# EasyEDA schematic 1-Schematic_Trial Project.json
TITLE: Sheet_1; REV: 1.0; Date: 2025-05-23; Sheet: 1/1; Drawn By: athulkrishnaat7; Company: Your Company
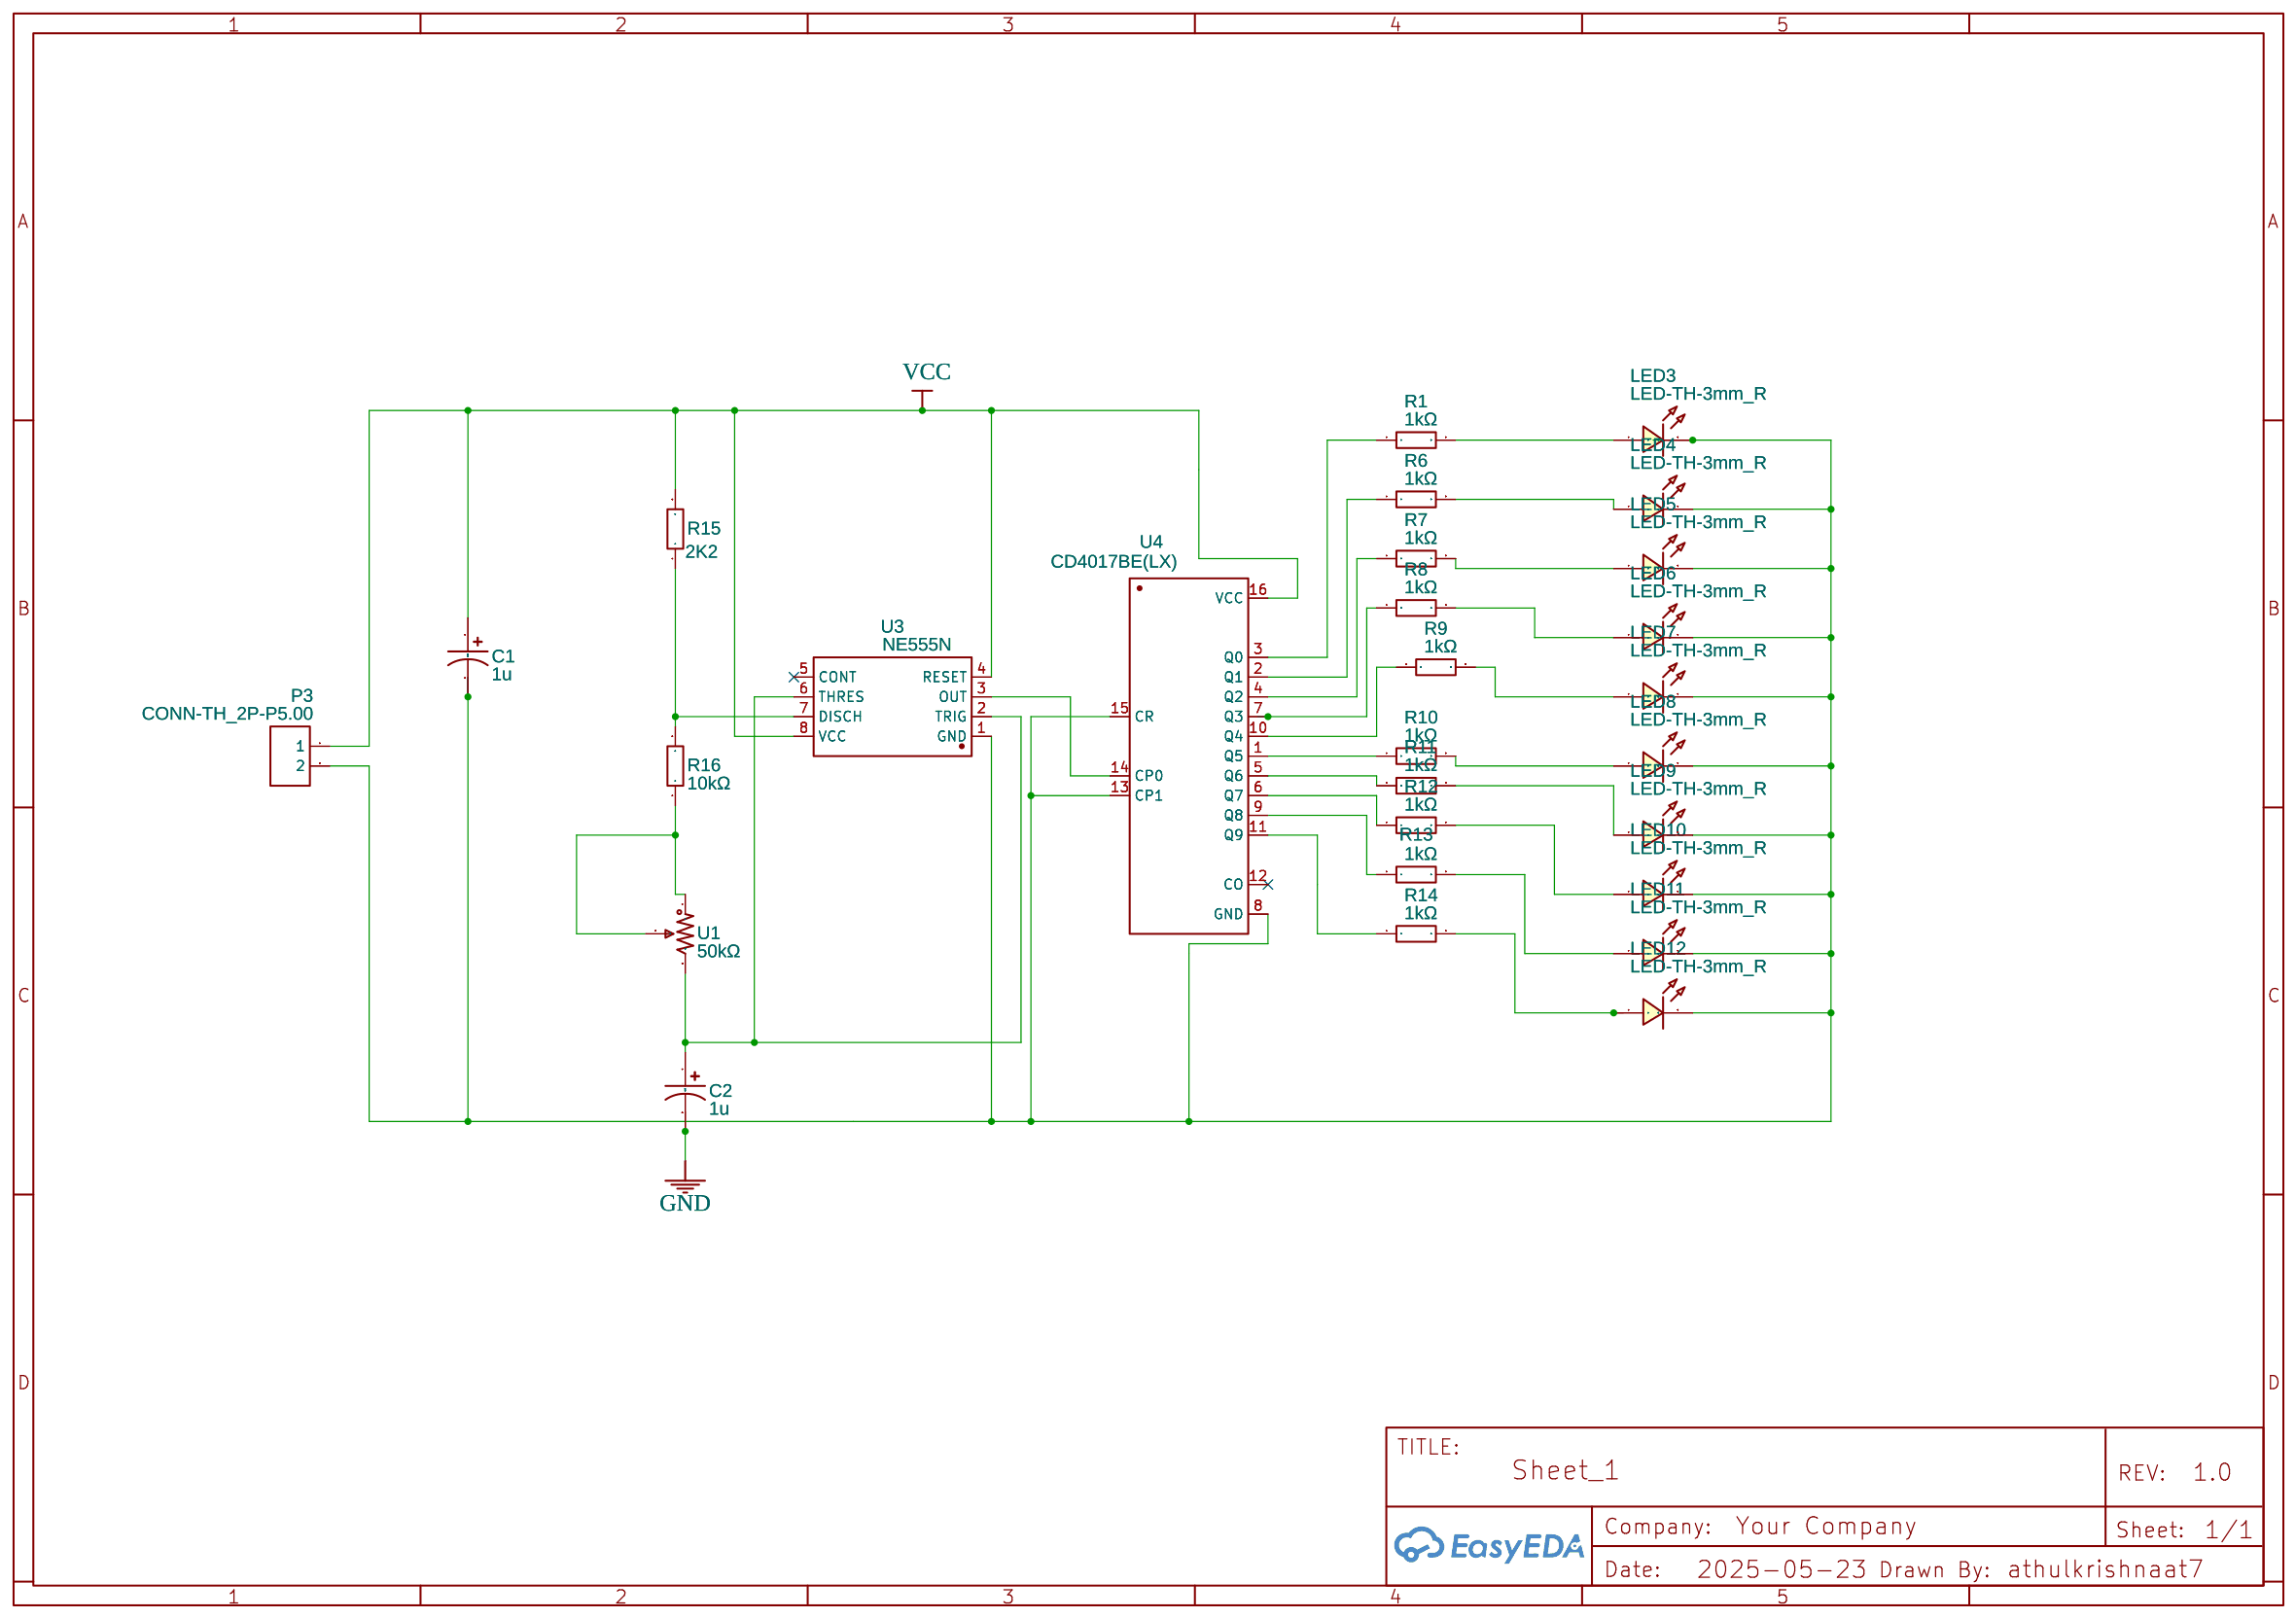
[diagram p0: schematic sheet]

## Parts
C1  1u  [CASE-A_3216]
C2  1u  [CASE-A_3216]
LED3  LED-TH-3mm_R  [LED-TH_BD3.0_RED]
LED4  LED-TH-3mm_R  [LED-TH_BD3.0_RED]
LED5  LED-TH-3mm_R  [LED-TH_BD3.0_RED]
LED6  LED-TH-3mm_R  [LED-TH_BD3.0_RED]
LED7  LED-TH-3mm_R  [LED-TH_BD3.0_RED]
LED8  LED-TH-3mm_R  [LED-TH_BD3.0_RED]
LED9  LED-TH-3mm_R  [LED-TH_BD3.0_RED]
LED10  LED-TH-3mm_R  [LED-TH_BD3.0_RED]
LED11  LED-TH-3mm_R  [LED-TH_BD3.0_RED]
LED12  LED-TH-3mm_R  [LED-TH_BD3.0_RED]
P3  CONN-TH_2P-P5.00  [CONN-TH_2P-P5.00]
R1  1kΩ  [R1210]
R6  1kΩ  [R1210]
R7  1kΩ  [R1210]
R8  1kΩ  [R1210]
R9  1kΩ  [R1210]
R10  1kΩ  [R1210]
R11  1kΩ  [R1210]
R12  1kΩ  [R1210]
R13  1kΩ  [R1210]
R14  1kΩ  [R1210]
R15  2K2  [R1210]
R16  10kΩ  [R1210]
U1  50kΩ  [RES-ADJ-SMD_RM065-V1]
U3  NE555N  [SOIC-8_L4.9-W3.9-P1.27-LS6.2-BL]
U4  CD4017BE(LX)  [SOIC-16_L9.9-W3.9-P1.27-LS6.0-BR]

## Library data of the parts
C1 C2 = C_Tan_SMD_A_US: Contributor: LCEDA_Lib
LED3-LED12 = LED-TH-3mm_R: Manufacturer: EVERLIGHT(台湾亿光); Manufacturer Part: 204-10SDRD/S530-A3-L; Supplier Part: C84774; Supplier: LCSC; Contributor: LCEDA_Lib
P3 = CONN-TH_2P-P5.00: Supplier: LCSC; Contributor: LCEDA_Lib
R1 R6-R16 = CR1210J30102G: Contributor: LCSC; Supplier: LCSC; Supplier Part: C102400; Manufacturer: LIZ(丽智电子); JLCPCB Part Class: Extended Part
U1 = 67WR50KLF: Supplier: LCSC; Supplier Part: C6826043; Manufacturer: TT Electronics; Contributor: lcsc; JLCPCB Part Class: Extended Part
U3 = NE555N: Contributor: LCSC; Supplier: LCSC; Supplier Part: C398063; Manufacturer: HGSEMI(华冠); JLCPCB Part Class: Extended Part
U4 = CD4017BE(LX): Supplier: LCSC; Supplier Part: C32710674; Manufacturer: LX(灵星芯微); Contributor: lcsc; JLCPCB Part Class: Extended Part

## Nets
GND: C1.2 C2.2 LED3.2 LED4.2 LED5.2 LED6.2 LED7.2 LED8.2 LED9.2 LED10.2 LED11.2 LED12.2 P3.2 U3.1(GND) U4.8(GND) U4.13(CP1) U4.15(CR)
VCC: C1.1 P3.1 R15.2 U3.4(RESET) U3.8(VCC) U4.16(VCC)
Net-(C2-1): C2.1 U1.3 U3.2(TRIG) U3.6(THRES)
Net-(LED3-1): LED3.1 R1.2
Net-(LED4-1): LED4.1 R6.2
Net-(LED5-1): LED5.1 R7.2
Net-(LED6-1): LED6.1 R8.2
Net-(LED7-1): LED7.1 R9.2
Net-(LED8-1): LED8.1 R10.2
Net-(LED9-1): LED9.1 R11.2
Net-(LED10-1): LED10.1 R12.2
Net-(LED11-1): LED11.1 R13.2
Net-(LED12-1): LED12.1 R14.2
Net-(R1-1): R1.1 U4.3(Q0)
Net-(R6-1): R6.1 U4.2(Q1)
Net-(R7-1): R7.1 U4.4(Q2)
Net-(R8-1): R8.1 U4.7(Q3)
Net-(R9-1): R9.1 U4.10(Q4)
Net-(R10-1): R10.1 U4.1(Q5)
Net-(R11-1): R11.1 U4.5(Q6)
Net-(R12-1): R12.1 U4.6(Q7)
Net-(R13-1): R13.1 U4.9(Q8)
Net-(R14-1): R14.1 U4.11(Q9)
Net-(R15-1): R15.1 R16.2 U3.7(DISCH)
Net-(R16-1): R16.1 U1.1 U1.2
Net-(U3-3): U3.3(OUT) U4.14(CP0)

Not connected (* = marked no-connect by the designer): U3 5(CONT)*; U4 12(CO)*
